# Altium schematic sheet DCP020505U.SchDoc
size A; SheetNumber: 4; SheetTotal: 6
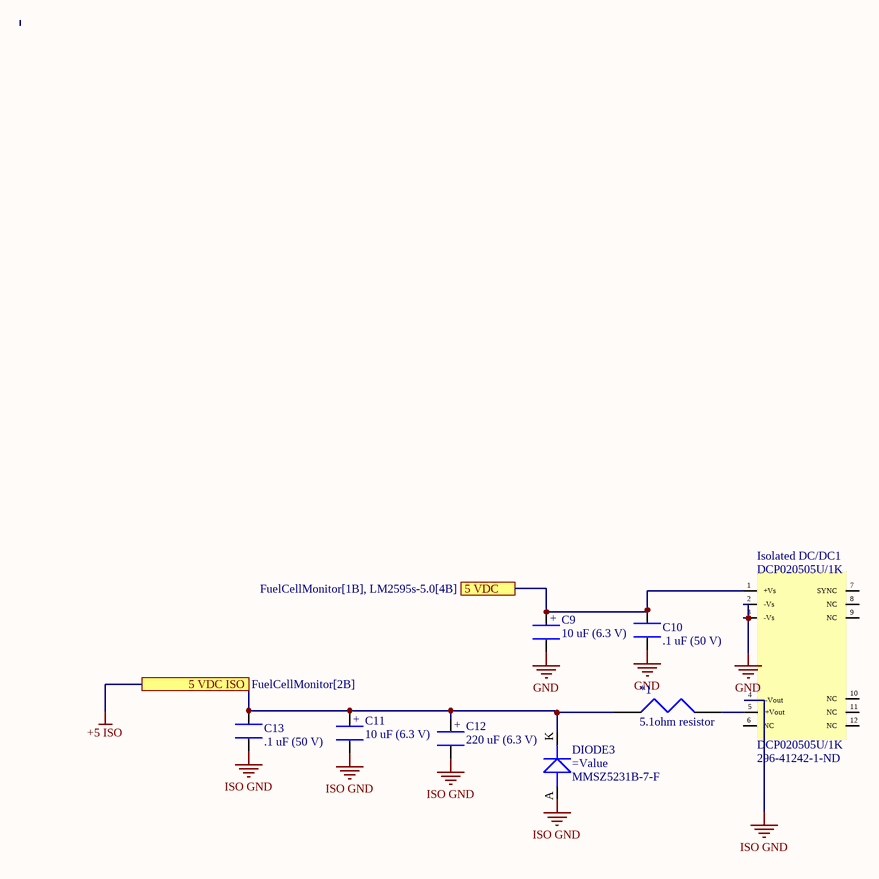
[diagram p0: DCP020505U.SchDoc]

## Parts
*1  5.1ohm resistor  [5.1 ohm resistor]
C9  10 uF (6.3 V)  [10 uF cap]
C10  .1 uF (50 V)  [.1uF capacitor]
C11  10 uF (6.3 V)  [10 uF cap]
C12  220 uF (6.3 V)  [220 uf cap]
C13  .1 uF (50 V)  [.1uF capacitor]
DIODE3  (no value)  [MMSZ5231B-7-F Zener diode]
Isolated_DC/DC1  DCP020505U/1K  Supplier Part Number 1: 296-41242-1-ND  [DCP020505U - duplicate]

## Ports
5 VDC (see FuelCellMonitor[1B], LM2595s-5.0[4B]), 5 VDC ISO (see FuelCellMonitor[2B])

## Nets
+5 ISO: *1.1 C11.1 C12.1 C13.2 DIODE3.K ; port 5 VDC ISO
GND: C9.2 C10.1 Isolated_DC/DC1.2(-Vs) Isolated_DC/DC1.3(-Vs)
ISO GND: C11.2 C12.2 C13.1 DIODE3.A Isolated_DC/DC1.4(-Vout)
5 VDC: C9.1 C10.2 Isolated_DC/DC1.1(+Vs) ; port 5 VDC
Net*1_2: *1.2 Isolated_DC/DC1.5(+Vout)

Not connected (* = marked no-connect by the designer): Isolated_DC/DC1 6(NC) 7(SYNC) 8(NC) 9(NC) 10(NC) 11(NC) 12(NC)

## Notes on the sheet
- (in symbol 10 uF cap) +
- (in symbol 220 uF capacitor) +

## Library data of the parts
C9 C11 = 10 uF cap
C10 C13 = .1 uF cap
C12 = 220 uF capacitor
DIODE3 = MMSZ5231B-7-F: Zener diode; Manufacturer: STMicroelectronics; Max Surge Current: 80A; Average Rectified Current: 3A; Max Reverse Leakage Current: 2mA; Element Configuration: Single; Polarity: Standard; Voltage Rating (DC): 40V; Forward Voltage: 950mV; Capacitance: 190pF; Supplier 1: Mouser; RoHS: Yes; Category: Rectifier Diodes; Stock 1: 125419; Pricing 1: 1=0.47000, 10=0.38600, 50=0.38600, 100=0.26300, 600=0.19700, 1000=0.19700, 1200=0.14700, 2400=0.12700, 9600=0.11900, 10000=0.11900 (USD); Mount: Through Hole; Case/Package: DO-201AD; Number of Pins: 2; Weight: 0.01lb; Min Operating Temperature: -65°C; Max Operating Temperature: 150°C; Package Quantity: 1; Packaging: Tape and Reel; Max Forward Surge Current (Ifsm): 80A; Current Rating: 3A; Output Current: 3A; Max Reverse Voltage (DC): 40V; Series: -; Forward Current: 3A; Max Reverse Current: 2mA; Max Repetitive Reverse Voltage (Vrrm): 40V; Peak Non-Repetitive Surge Current: 80A; Length: 9.5mm; Width: 5.3mm; Height: 5.3mm; Radiation Hardening: No; Lead Free: Lead Free; RoHS Compliant: Yes; REACH SVHC: No SVHC; ComponentLink1URL: https://datasheet.ciiva.com/1177/1689683-1177129.pdf?src-supplier=Element14; ComponentLink1Description: https://datasheet.ciiva.com/1177/1689683-1177129.pdf?src-supplier=Element14; ComponentLink2URL: https://datasheet.ciiva.com/26339/168275-da-01-en-schottky-barrier-rectif-axial-1n5822-26339005.pdf?src-supplier=Conrad; ComponentLink2Description: https://datasheet.ciiva.com/26339/168275-da-01-en-schottky-barrier-rectif-axial-1n5822-26339005.pdf?src-supplier=Conrad; ComponentLink3URL: https://datasheet.ciiva.com/16303/cd00001626-16303311.pdf?src-supplier=Future+Electronics; ComponentLink3Description: https://datasheet.ciiva.com/16303/cd00001626-16303311.pdf?src-supplier=Future+Electronics; ComponentLink4URL: https://datasheet.ciiva.com/916/cd00001626-916051.pdf?src-supplier=Digi-Key; ComponentLink4Description: https://datasheet.ciiva.com/916/cd00001626-916051.pdf?src-supplier=Digi-Key; ComponentLink5URL: https://datasheet.ciiva.com/916/cd00001626-916050.pdf?src-supplier=Digi-Key; ComponentLink5Description: https://datasheet.ciiva.com/916/cd00001626-916050.pdf?src-supplier=Digi-Key; Supplier Part Number 1: 511-1N5822; Manufacturer Part Number: MMSZ5231B-7-F
Isolated_DC/DC1 = DCP020505U/1K: Miniature, 2W Isolated Unregulated DC/DC Converters 12-SOP -40 to 85; Manufacturer: Texas Instruments; Number of Outputs: 1; Efficiency: 80%; Max Output Current: 400mA; Max Input Voltage: 5.5V; Min Input Voltage: 4.5V; Voltage - Output 1: 5V; Isolation Voltage: 1kV; Max Power Dissipation: 90mW; Switching Frequency: 400kHz; Max Output Voltage: 5.25V; Min Output Voltage: 4.75V; Quiescent Current: 18mA; Output Type: Fixed; Supplier 1: Digi-Key; Manufacturer Part Number: DCP020505U/1K; RoHS: Yes; Category: Integrated Circuits (ICs); Case/Package: SOP; Number of Pins: 12; Min Operating Temperature: -40°C; Max Operating Temperature: 85°C; Packaging: Tape and Reel; Features: OTP; Package Quantity: 1000; Output Voltage: 5V; Output Current: 400mA; Output Power: 2W; Current - Output 1: 400mA; Max Output Power: 2W; Series: DCP02; Length: 0.71inch; Width: 0.3inch; Height: 0.1inch; Radiation Hardening: No; Lead Free: Lead Free; RoHS Compliant: Yes; ComponentLink1URL: https://datasheet.ciiva.com/2035/dcp020503-2035713.pdf?src-supplier=Digi-Key; ComponentLink1Description: https://datasheet.ciiva.com/2035/dcp020503-2035713.pdf?src-supplier=Digi-Key